# EAGLE design UC Battery 4xAA (EAGLE 6.2)
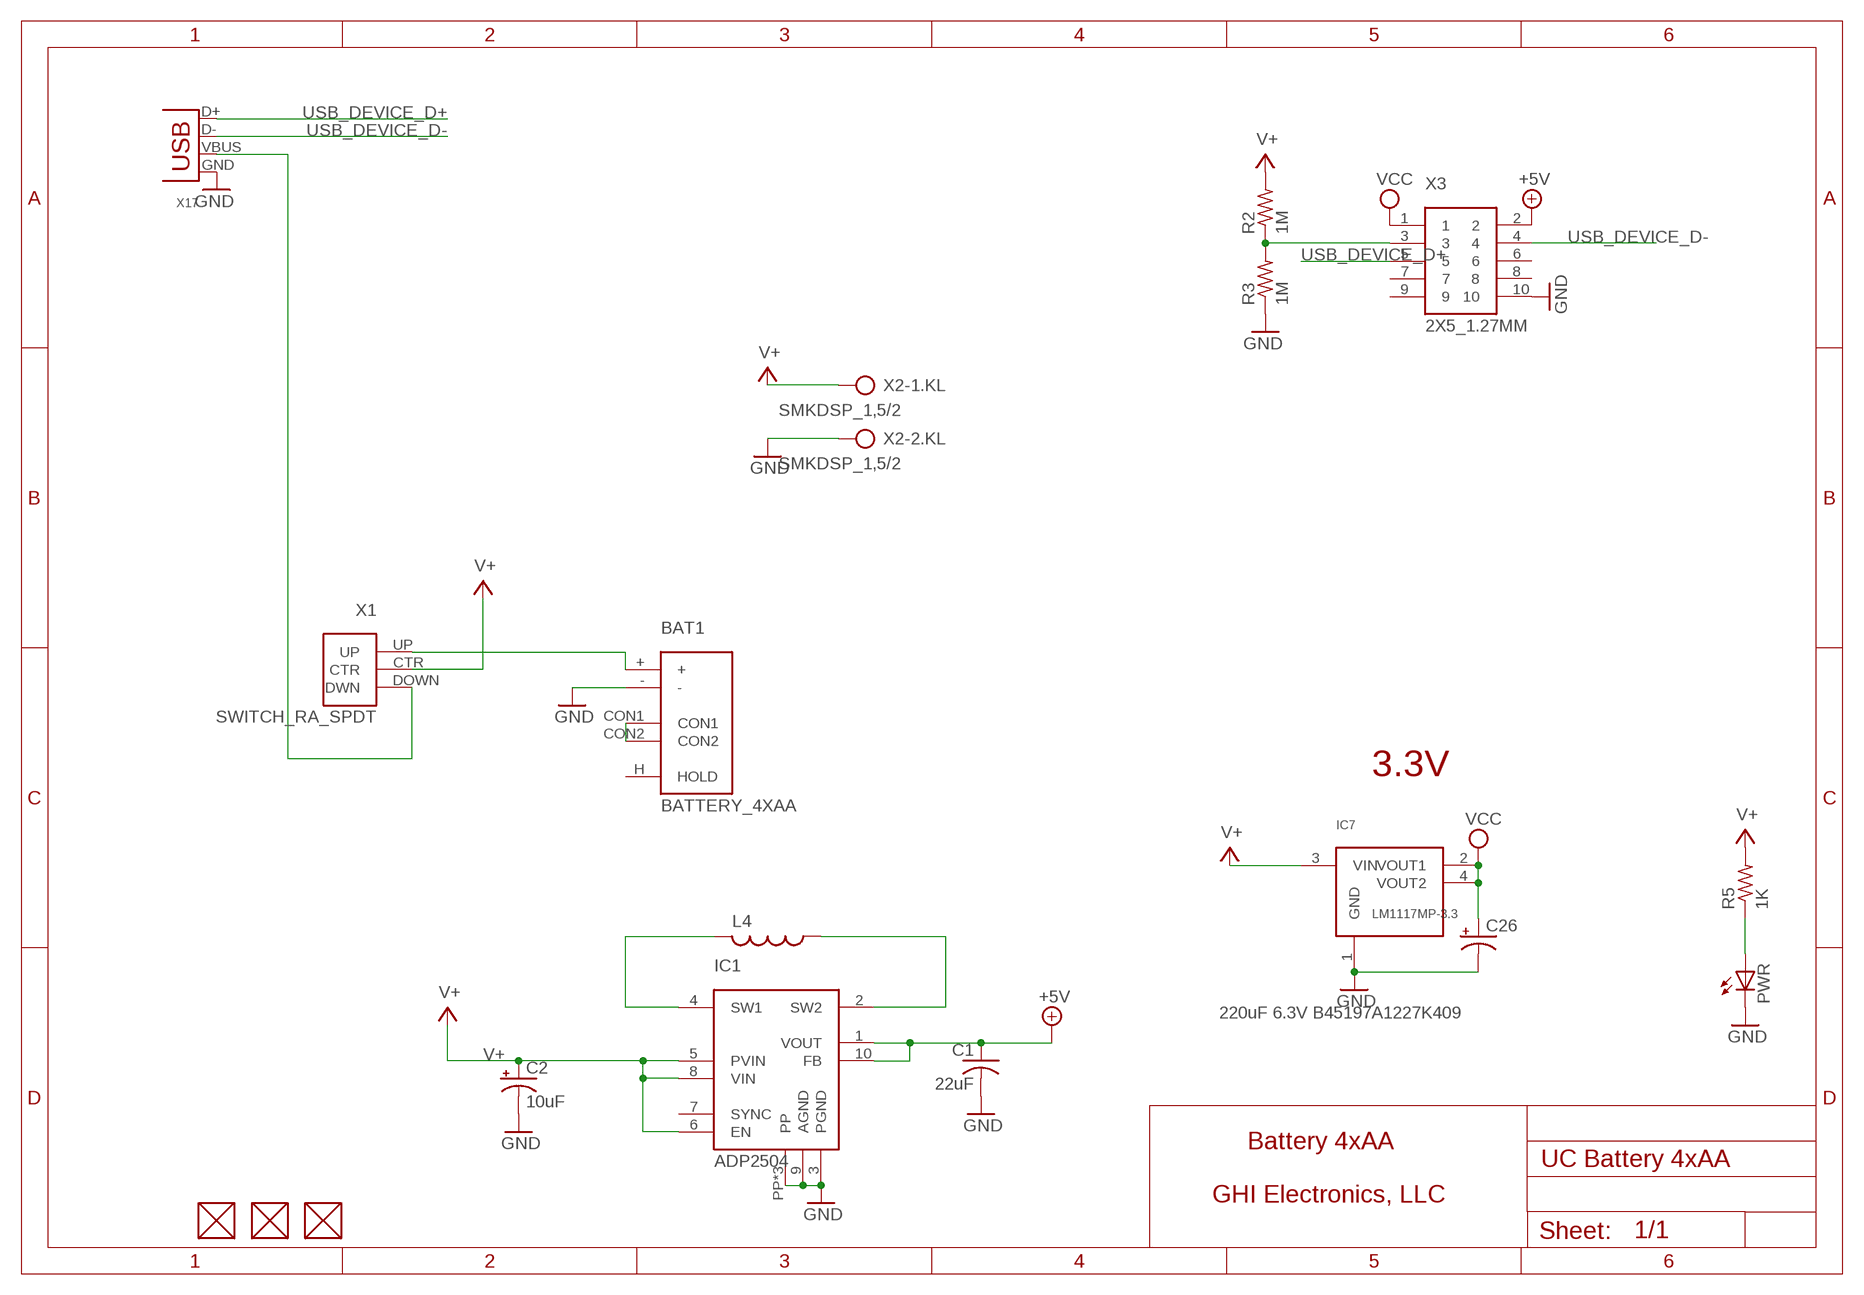
[diagram p0: schematic, sheet 1]

## Parts
BAT1  BATTERY_4XAA  [BATTERY_4XAA]
C1  22uF  C-USC0805K  [C0805K]
C2  10uF  CPOL-USCT3528  [CT3528]
C26  220uF 6.3V B45197A1227K409  CPOL-USD/7343-31W  [D/7343-31W]
FUD1  FIDUCIAL  [FIDUCIAL_40MIL]
FUD2  FIDUCIAL  [FIDUCIAL_40MIL]
FUD3  FIDUCIAL  [FIDUCIAL_40MIL]
IC1  ADP2504  [QFN10_3X3]
IC7  LM1117MP-3.3  LM1117  [SOT223]
L4  L-USL2825P  [L2825P]
PWR  LEDCHIPLED_0805  [CHIPLED_0805]
R2  1M  R-US_R0603  [R0603]
R3  1M  R-US_R0603  [R0603]
R5  1K  R-US_R0603  [R0603]
X1  SWITCH_RA_SPDT  [SWITCH_RA_SPDT]
X2  SMKDSP_1,5/2  [SMKDSP_1,5/2]
X3  2X5_1.27MM  [2X5_1.27MM]
X17  DX2R005HN2E700  USB-MB-S  [USB-MB-S]

## Nets
+5V [power]: C1.1 IC1.1(VOUT) IC1.10(FB) X3.2
GND [power]: BAT1.- C1.2 C2.- C26.- IC1.3(PGND) IC1.9(AGND) IC1.PP IC1.PP@1(PP) IC1.PP@2(PP) IC7.1(GND) PWR.C R3.1 X2.2 X3.10 X17.GND
N$1: PWR.A R5.1
N$2: R2.1 R3.2 X3.3
N$3: BAT1.CON1 BAT1.CON2
N$4: BAT1.+ X1.UP
N$5: IC1.4(SW1) L4.2
N$6: IC1.2(SW2) L4.1
N$7: X1.DOWN(DWN) X17.VBUS
USB_DEVICE_D+: X3.5 X17.D+
USB_DEVICE_D-: X3.4 X17.D-
V+: C2.+ IC1.5(PVIN) IC1.6(EN) IC1.8(VIN) IC7.3(VIN) R2.2 R5.2 X1.CTR X2.1
VCC [power]: C26.+ IC7.2(VOUT1) IC7.4(VOUT2) X3.1
Unconnected: BAT1.H(HOLD) FUD1.P$1 FUD2.P$1 FUD3.P$1 IC1.7(SYNC) X3.6 X3.7 X3.8 X3.9

## Notes on the sheet
- 3.3V
- Battery 4xAA
- GHI Electronics, LLC

## Library data of the parts
BAT1 = GHI:BATTERY_4XAA
C1 = rcl:C-US: CAPACITOR, American symbol
C2 C26 = rcl:CPOL-US: POLARIZED CAPACITOR, American symbol
FUD1-FUD3 = GHI:FIDUCIAL
IC1 = GHI:ADP2504
IC7 = GHI:LM1117
L4 = rcl:L-US: INDUCTOR, American symbol
PWR = led:LED: LED OSRAM: - CHIPLED LG R971, LG N971, LY N971, LG Q971, LY Q971, LO R971, LY R971 LH N974, LH R974 LS Q976, LO Q976, LY Q976 LO Q996 - Hyper CHIPLED LW Q18S LB Q993, LB Q99A, LB R99A - SideLED LS A670, LO A670, LY A670, LG A670, LP A670 LB A673, LV A673, LT A673, LW A673 LH A674 LY A675 LS A676, LA A676, LO A676, LY A676, LW A676 LS A679, LY A679, LG A679 - Hyper Micro SIDELED® LS Y876, LA Y876, LO Y876, LY Y876 LT Y87S - SmartLED LW L88C, LW L88S LB L89C, LB L89S, LG L890 LS L89K, LO L89K, LY L89K LS L896, LA L896, LO L896, LY L896 - TOPLED LS T670, LO T670, LY T670, LG T670, LP T670 LSG T670, LSP T670, LSY T670, LOP T670, LYG T670 LG T671, LOG T671, LSG T671 LB T673, LV T673, LT T673, LW T673 LH T674 LS T676, LA T676, LO T676, LY T676, LB T676, LH T676, LSB T676, LW T676 LB T67C, LV T67C, LT T67C, LS T67K, LO T67K, LY T67K, LW E67C LS E67B, LA E67B, LO E67B, LY E67B, LB E67C, LV E67C, LT E67C LW T67C LS T679, LY T679, LG T679 LS T770, LO T770, LY T770, LG T770, LP T770 LB T773, LV T773, LT T773, LW T773 LH T774 LS E675, LA E675, LY E675, LS T675 LS T776, LA T776, LO T776, LY T776, LB T776 LHGB T686 LT T68C, LB T68C - Hyper Mini TOPLED® LB M676 - Mini TOPLED Santana® LG M470 LS M47K, LO M47K, LY M47K Source: http://www.osram.convergy.de LUXEON: - LUMILED® LXK2-PW12-R00, LXK2-PW12-S00, LXK2-PW14-U00, LXK2-PW14-V00 LXK2-PM12-R00, LXK2-PM12-S00, LXK2-PM14-U00 LXK2-PE12-Q00, LXK2-PE12-R00, LXK2-PE12-S00, LXK2-PE14-T00, LXK2-PE14-U00 LXK2-PB12-K00, LXK2-PB12-L00, LXK2-PB12-M00, LXK2-PB14-N00, LXK2-PB14-P00, LXK2-PB14-Q00 LXK2-PR12-L00, LXK2-PR12-M00, LXK2-PR14-Q00, LXK2-PR14-R00 LXK2-PD12-Q00, LXK2-PD12-R00, LXK2-PD12-S00 LXK2-PH12-R00, LXK2-PH12-S00 LXK2-PL12-P00, LXK2-PL12-Q00, LXK2-PL12-R00 Source: www.luxeon.com KINGBRIGHT: KA-3528ASYC Source: www.kingbright.com
R2 R3 R5 = rcl:R-US_: RESISTOR, American symbol
X1 = GHI:SWITCH_RA_SPDT
X2 = GHI2:SMKDSP_1,5/2: For Blue Wire Connector Block
X3 = GHI:2X5_1.27MM
X17 = con-usb-3:USB: USB Connectors

## Net classes
0 default: width 0.254 mm, drill 0.381 mm, clearance 0.203 mm

## Board
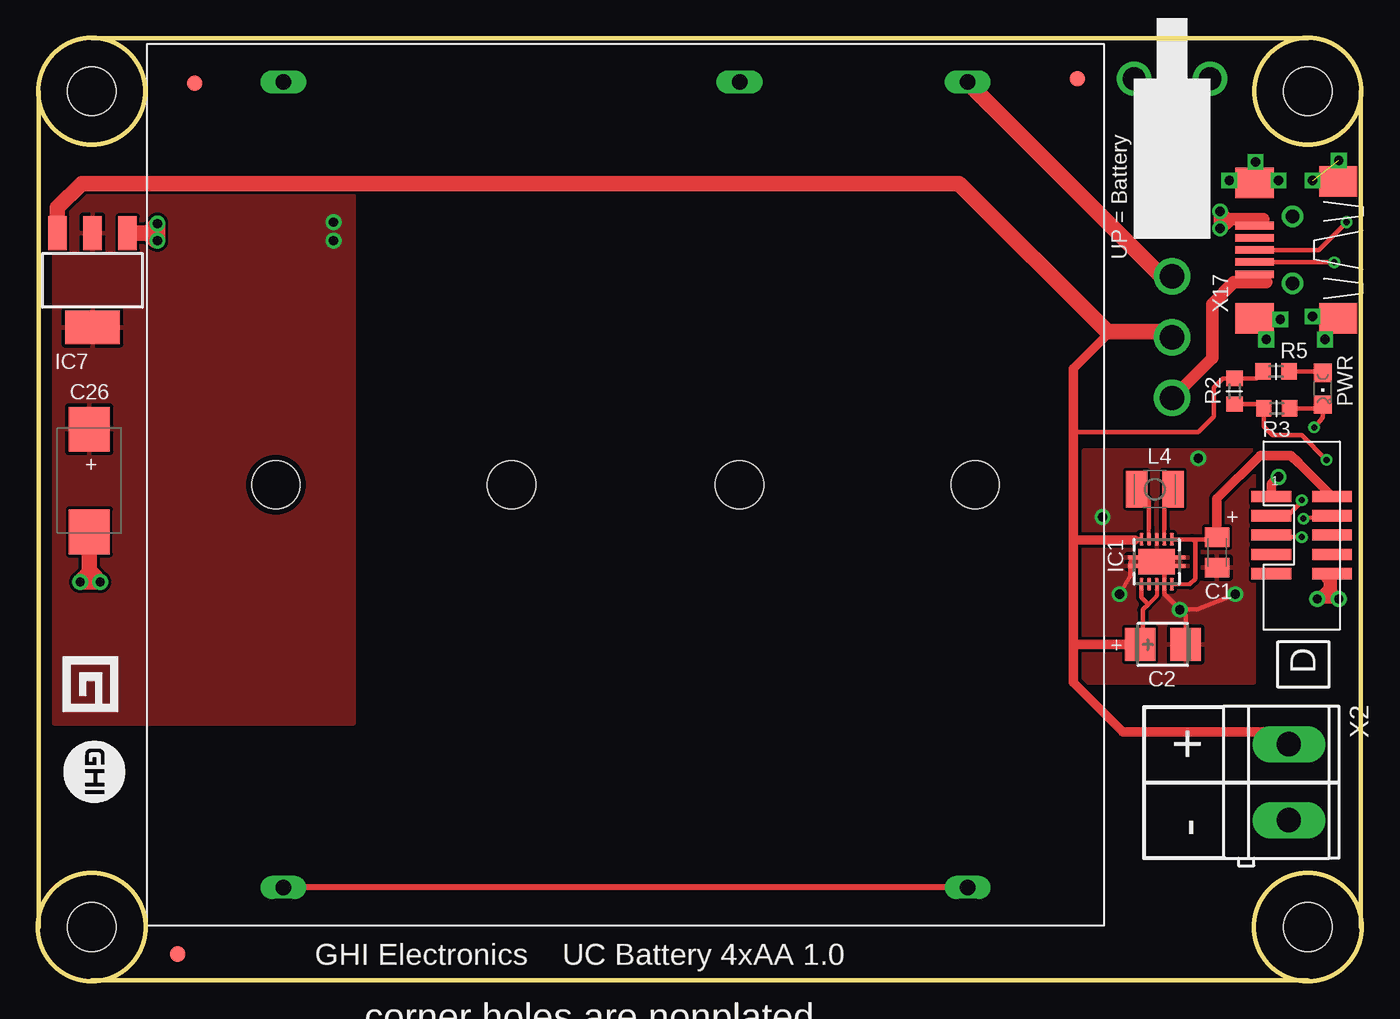
[diagram p1: board, top side]
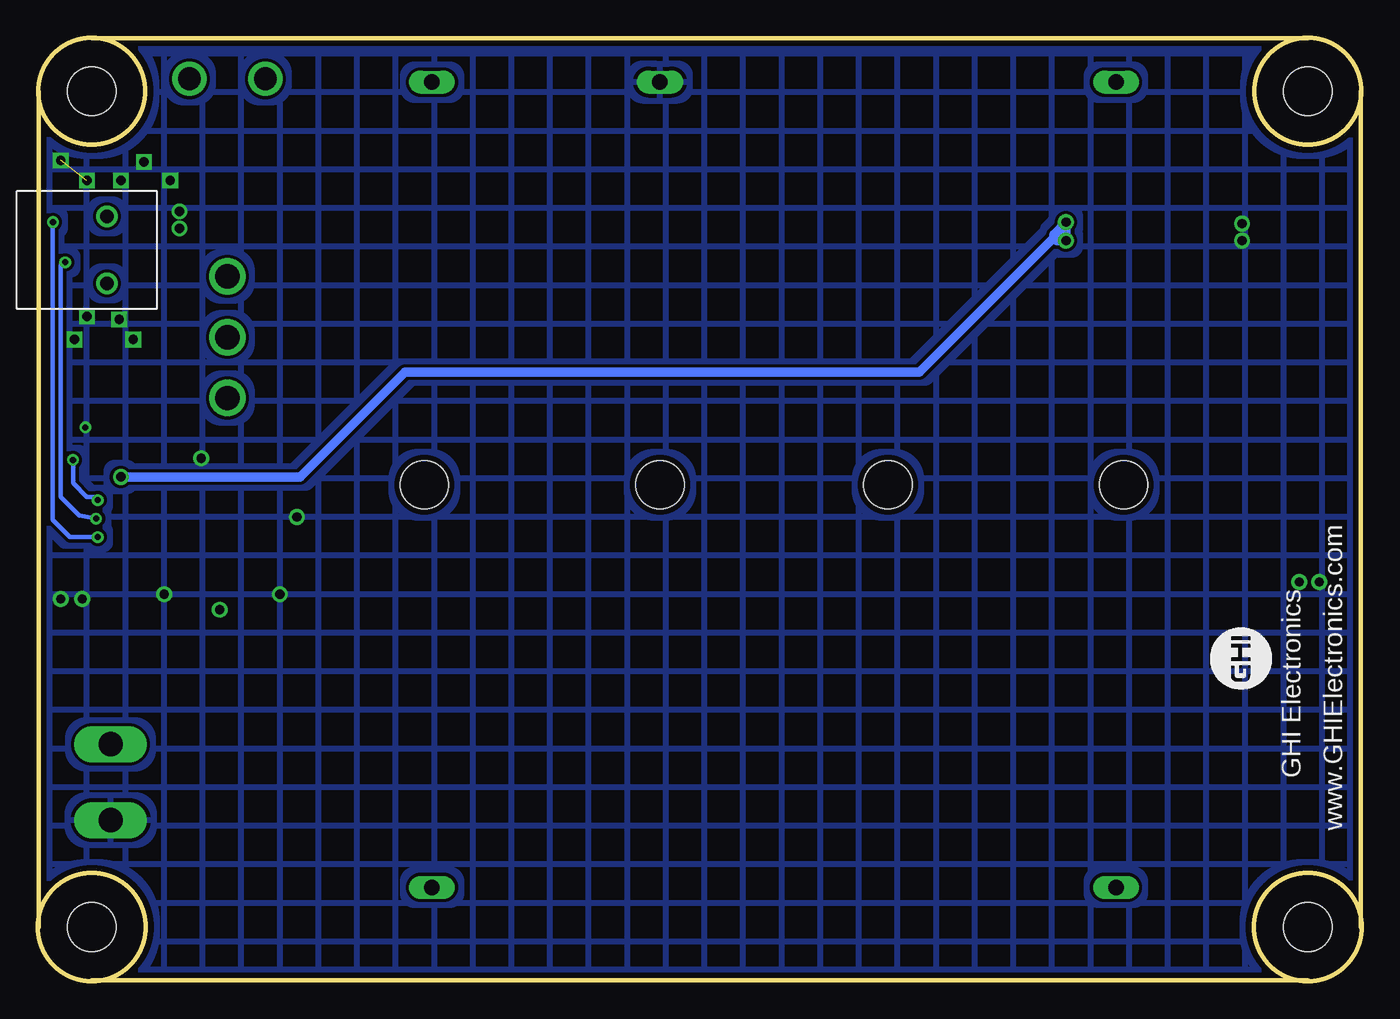
[diagram p2: board, bottom side, seen from below]

Size 87.07 x 62.04 mm. Coordinates in mm from the lower left corner, seen from the top.
Outline: 87.04,3.54 87.04,58.54
Outline: 0.04,58.54 0.04,3.54
Outline: 3.54,62.04 83.54,62.04
Outline: 83.54,0.04 3.54,0.04
Outline: circle at 3.54,58.54 radius 3.5
Outline: circle at 83.54,58.54 radius 3.5
Outline: circle at 83.54,3.54 radius 3.54
Outline: circle at 3.54,3.54 radius 3.54
Copper layers (1+16): Top 0.035mm / dielectric 1.5mm / Bottom 0.035mm
Design rules: minimum track width 8mil, minimum drill 12mil, track to track 8mil, track to pad 8mil, pad to pad 8mil, via to via 8mil, smd to smd 8mil, copper to edge 15mil, drill to drill 8mil, minimum pad ring 10mil, minimum via ring 7mil, stop-mask expansion 4mil, vias tented up to drill 50mil, thermal gap 10mil
Holes 3.2 mm at 3.54,3.54 83.54,58.54 3.54,58.54 83.54,3.54

### Footprints (pad centres in the part's own frame; a part is rotated, then mirrored left to right if it is on the bottom)
BATTERY_4XAA = drill 1.016 long: + -22,-27; - -7,-27; CON1 -22,26; CON2 23,26; H 23,-27 | hole 3.175: -22.5,-0.5; -7,-0.5; 8,-0.5; 23.5,-0.5
C0805K = smd 1.3 x 1.6: 1 -1,0; 2 1,0
CT3528 = smd 2 x 2.2: + 1.5,0; - -1.5,0
D/7343-31W = smd 2.95 x 2.7: + 3.375,0; - -3.375,0
FIDUCIAL_40MIL = smd 1.016 x 1.016: P$1 0,0
QFN10_3X3 = smd 0.28 x 0.85: 1 -1,-1.475; 2 -0.5,-1.475; 3 0,-1.475; 4 0.5,-1.475; 5 1,-1.475; 6 1,1.475; 7 0.5,1.475; 8 0,1.475; 9 -0.5,1.475; 10 -1,1.475 | smd 2.4 x 1.65: PP 0,0 | smd 3.8 x 0.28: PP@1 0,0.275; PP@2 0,-0.275
SOT223 = smd 1.219 x 2.235: 1 -2.311,-3.099; 2 0,-3.099; 3 2.311,-3.099 | smd 3.6 x 2.2: 4 0,3.099
L2825P = smd 1.4 x 2.4: 1 -1.2,0; 2 1.2,0
CHIPLED_0805 = smd 1.2 x 1.2: A 0,-1.05; C 0,1.05
R0603 = smd 1 x 1.1: 1 -0.85,0; 2 0.85,0
SWITCH_RA_SPDT = drill 1.6: CTR 0,17; DOWN 0,21; UP 0,13 | drill 1.5: G1 2.5,0; G2 -2.5,0
SMKDSP_1,5/2 = drill 1.6 pad 1.8 long: 1 -2.5,0; 2 2.5,0
2X5_1.27MM = smd 2.6 x 0.74: 1 -2,2.58; 2 2,2.58; 3 -2,1.31; 4 2,1.31; 5 -2,0.04; 6 2,0.04; 7 -2,-1.23; 8 2,-1.23; 9 -2,-2.5; 10 2,-2.5
USB-MB-S = smd 2.5 x 0.5: D+ 2.5,0; D- 2.5,0.8; GND 2.5,-1.6; ID 2.5,-0.8; VBUS 2.5,1.6 | smd 2.5 x 2: P$1 -3,-4.5; P$2 -3,4.5; P$3 2.5,-4.4; P$4 2.5,4.5 | drill 0.9: P$5 0,2.2; P$6 0,-2.2

### Placement (x,y rotation side)
BAT1  39.15,32.14 180 top
C1  77.57,28.18 270 top
C2  74,22.13 180 top
C26  3.38,32.92 90 top
FUD1  9.18,1.76 0 top
FUD2  10.3,59.07 0 top
FUD3  68.39,59.37 0 top
IC1  73.6,27.58 180 top
IC7  3.59,46.09 180 top
L4  73.48,32.35 180 top
PWR  84.52,38.96 180 top
R2  78.72,38.79 90 top
R3  81.49,37.67 180 top
R5  81.45,40.1 180 top
X1  74.61,59.35 180 top
X2  82.29,13.07 270 top
X3  83.14,29.29 0 top
X17  82.53,48.09 180 top

### Tracks (layer width: path | path; a pad name or v marks a point on that pad's centre or on a via)
+5V
  Top 0.254: IC1.10 75.78,26.1
  Top 0.305: IC1.1 75.93,29.05 | 75.93,29.05 77.03,29.05 C1.1 | 75.78,26.1 76.13,26.45 76.13,28.95 75.93,29.05
  Top 0.61: C1.1 77.57,31.74 80.4,34.58 82.43,34.58 82.94,34.08 82.94,34.07 X3.2
GND  (via drill 0.41, 0.61)  (1 unrouted)
  Top 0.305: IC1.PP@1 74.1,26.8 IC1.9 74.1,25.44 v75.12,24.42 | IC1.PP@2 72.15,27.85 71.87,27.57 71.87,26.65 v71.16,25.44 | v75.12,24.42 76.24,24.42 v78.78,25.44 | 77.15,27.17 C1.2 | C2.- 75.5,24.03 v75.12,24.42 | v83.96,36.41 84.52,37.06 PWR.C 84.28,37.67 R3.1
  Top 0.406: X17.GND 80.17,49.69 80.6,50.12
  Top 0.61: X3.10 85.14,25.58 v85.58,25.13 v84.16,25.13 84.87,25.84 84.87,26.35 84.77,26.45
  Top 0.813: 80.6,50.12 78.27,50.12 v77.76,50.63 v77.76,49.51 77.86,49.51 78.37,50.02
  Top 1.016: C26.- 3.38,26.85 v2.78,26.25 v4.1,26.25 3.59,26.76 | IC7.1 7.23,49.19 7.25,49.21 | 7.25,49.21 v7.86,49.82 v7.86,48.7 7.76,48.7 7.25,49.21
  other vias: 76.34,34.38 70.04,30.52 78.37,52.66 80.1,53.88 81.62,52.66 83.86,52.66 85.58,53.99 80.81,42.2 81.72,43.52 83.86,43.72 84.67,42.2
  pour Bottom (hatched): 0.14,0.14 0.14,61.91 86.5,61.91 86.5,0.14
  pour Top: 68.82,34.88 68.82,19.64 79.99,19.64 79.99,34.88
N$1
  Top 0.305: R5.1 84.43,40.1 PWR.A
N$2  (via drill 0.41)
  Top 0.305: R2.1 80.36,37.94 R3.2 80.64,36.48 81.21,35.9 83.14,35.9 v84.77,34.27 | v83.14,31.63 83.14,31.53 82.23,30.62 81.15,30.62 X3.3
  Bottom 0.305: v84.77,34.27 84.77,32.75 83.86,31.84 83.35,31.84 v83.14,31.63
N$3
  Top 0.406: BAT1.CON1 BAT1.CON2
N$4
  Top 1.016: X1.UP 73.94,46.35 BAT1.+
N$5
  Top 0.254: IC1.4 73.1,29.79 73.09,29.8
  Top 0.305: L4.2 73.1,31.53 73.09,31.52 73.09,29.8
N$6
  Top 0.254: IC1.2 74.1,29.7
  Top 0.305: L4.1 74.1,31.77 74.1,31.76 74.1,29.7
N$7
  Top 0.305: X17.VBUS 80.27,46.49 80.81,45.96
  Top 0.813: 80.81,45.96 78.67,45.96 77.25,44.54 77.25,40.99 X1.DOWN
USB_DEVICE_D+  (via drill 0.41)
  Top 0.305: X17.D+ 84.26,48.09 v86.09,49.92 | v83.14,29.19 81.27,29.19 X3.5
  Bottom 0.305: v86.09,49.92 86.09,30.31 84.97,29.19 v83.14,29.19
USB_DEVICE_D-  (via drill 0.41)
  Top 0.305: X17.D- 85.27,47.29 v85.28,47.28 | v83.25,30.41 85.12,30.62 X3.4
  Bottom 0.305: v85.28,47.28 85.38,47.28 85.58,47.08 85.58,31.84 84.36,30.62 v83.25,30.41
V+
  Top 0.254: IC1.8 73.6,25.34 73.04,24.78
  Top 0.305: IC1.5 72.23,29.05 72.17,28.99 | 68.11,36.31 68.31,36.1 76.34,36.1 77.35,37.12 77.35,39.05 77.95,39.64 R2.2 80.14,39.64 R5.2 | C2.+ 72.68,22.31 72.68,24.42 73.04,24.78 72.6,25.21 IC1.6
  Top 0.61: C2.+ 68.26,22.13 68.11,22.29 | 68.11,22.29 68.11,19.64 71.36,16.39 81.47,16.39 X2.1 | 68.11,22.29 68.11,28.99 | 68.11,28.99 68.11,36.31 68.11,40.27 70.55,42.71 | 72.17,28.99 68.11,28.99
  Top 1.016: IC7.3 1.28,50.86 2.88,52.46 60.59,52.46 70.34,42.71 70.55,42.71 74.81,42.71 75.32,42.2 74.76,42.2 X1.CTR
VCC  (via drill 0.61)
  Top 0.61: X3.1 81.14,32.67 v81.62,33.16
  Bottom 0.61: v81.62,33.16 69.83,33.16 62.93,40.07 29.09,40.07 20.25,48.91 | 20.25,48.91 19.44,49.72 v19.44,48.7 20.05,48.7 20.25,48.91 | 20.25,48.91 20.25,49.11 v19.44,49.92
  pour Top: 1.05,52.77 1.05,16.95 20.76,16.95 20.76,52.77

### Text on the board
tPlace: UP = Battery | + | + | + | D | + | - | GHI Electronics UC Battery 4xAA 1.0 | corner holes are nonplated | red PCB with white text | do not add manufacturing codes
bPlace: GHI Electronics | www.GHIElectronics.com